# EAGLE design Encoder_v1 (EAGLE 7.5.0)
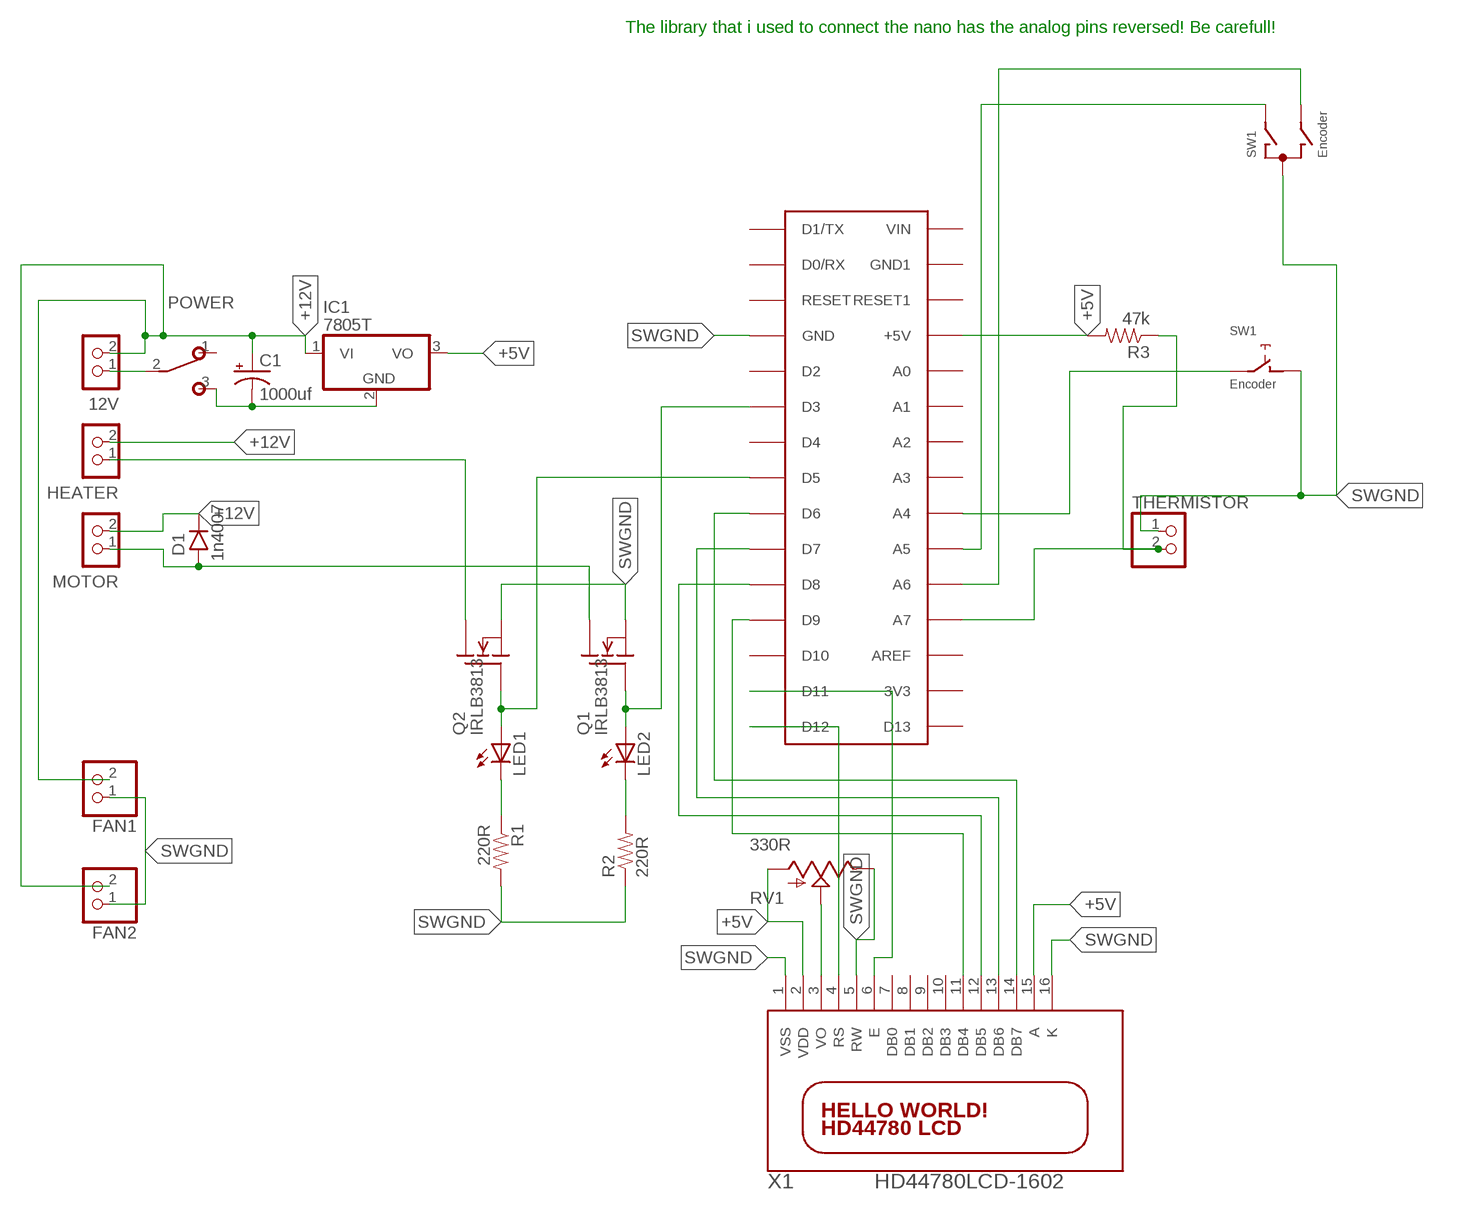
[diagram p0: schematic, sheet 1]

## Parts
12V  CON_TERMINAL_BLOCK_02-5MM  [TERMINAL_BLOCK_2P_5]
A01  ARDUINO NANO  ARDUINONANO  [PDIP-32]
C1  1000uf  CAP_POLPTH4  [CPOL-RADIAL-1000UF-25V]
D1  1n4007  1N400X.4  [DO41-4]
FAN1  PINHD-1X2  [1X02]
FAN2  PINHD-1X2  [1X02]
HEATER  CON_TERMINAL_BLOCK_02-5MM  [TERMINAL_BLOCK_2P_5]
IC1  7805T  [TO220H]
LED1  LED5MM  [LED5MM]
LED2  LED5MM  [LED5MM]
MOTOR  CON_TERMINAL_BLOCK_02-5MM  [TERMINAL_BLOCK_2P_5]
POWER  SPDT  [M9040P]
Q1  IRLB3813  IRF620  [TO220]
Q2  IRLB3813  IRF620  [TO220]
R1  220R  RESISTORPTH-1/4W  [AXIAL-0.4]
R2  220R  RESISTORPTH-1/4W  [AXIAL-0.4]
R3  47k  RESISTORPTH-1/4W  [AXIAL-0.4]
RV1  330R  POTTRIM  [TRIM_POT]
SW1  Encoder  EC12E_SW  [ALPS_EC12E_SW]
THERMISTOR  PINHD-1X2  [1X02]
X1  HD44780LCD-1602  [LCD1602]

## Nets
+5V: A01.+5V IC1.3(VO) R3.P$2 RV1.3(A) X1.2(VDD) X1.15(A)
+12V: 12V.2 C1.1(+) D1.C FAN1.2 FAN2.2 HEATER.2 IC1.1(VI) MOTOR.2
N$1: LED1.K(C) R1.P$1
N$2: RV1.1(S) X1.3(VO)
N$3: A01.A4 SW1.E
N$4: 12V.1 POWER.2(P)
N$5: A01.A6 SW1.B
N$6: A01.A7 R3.P$1 THERMISTOR.2
N$7: A01.A5 SW1.A
N$8: LED2.K(C) R2.P$2
N$9: A01.D5 LED1.A Q2.1(G)
N$10: A01.D6 X1.14(DB7)
N$11: A01.D7 X1.13(DB6)
N$12: D1.A MOTOR.1 Q1.2(D)
N$13: A01.D3 LED2.A Q1.1(G)
N$14: A01.D8 X1.12(DB5)
N$15: A01.D9 X1.11(DB4)
N$16: HEATER.1 Q2.2(D)
N$17: A01.D11 X1.6(E)
N$18: A01.D12 X1.4(RS)
SWGND: A01.GND C1.2(-) FAN1.1 FAN2.1 IC1.2(GND) POWER.3(S) Q1.3(S) Q2.3(S) R1.P$2 R2.P$1 RV1.2(E) SW1.C SW1.D THERMISTOR.1 X1.1(VSS) X1.5(RW) X1.16(K)
Unconnected: A01.3V3 A01.A0 A01.A1 A01.A2 A01.A3 A01.AREF A01.D0/RX A01.D1/TX A01.D2 A01.D4 A01.D10 A01.D13 A01.GND1 A01.RESET A01.RESET1 A01.VIN POWER.1(O) SW1.GND1(G) SW1.GND2(G) X1.7(DB0) X1.8(DB1) X1.9(DB2) X1.10(DB3)

## Notes on the sheet
- The library that i used to connect the nano has the analog pins reversed! Be carefull!

## Library data of the parts
12V HEATER MOTOR = dp_devices:CON_TERMINAL_BLOCK_02: 2 poles wire to board terminal block
A01 = jet-lib:ARDUINONANO
C1 = SparkFun-Passives:CAP_POL: Capacitor Polarized These are standard SMD and PTH capacitors. Normally 10uF, 47uF, and 100uF in electrolytic and tantalum varieties. Always verify the external diameter of the through hole cap, it varies with capacity, voltage, and manufacturer. The EIA devices should be standard.
D1 = gm-diodes:1N400X: Rectifier Diodes often used in power supply to prevent damage from reverse polarization
FAN1 FAN2 THERMISTOR = pinhead:PINHD-1X2: PIN HEADER
IC1 = adafruit:78*: Positive VOLTAGE REGULATOR Added bigger pads to the TO-92 package
LED1 LED2 = adafruit:LED: LED OSRAM: - CHIPLED LG R971, LG N971, LY N971, LG Q971, LY Q971, LO R971, LY R971 LH N974, LH R974 LS Q976, LO Q976, LY Q976 LO Q996 - Hyper CHIPLED LW Q18S LB Q993, LB Q99A, LB R99A - SideLED LS A670, LO A670, LY A670, LG A670, LP A670 LB A673, LV A673, LT A673, LW A673 LH A674 LY A675 LS A676, LA A676, LO A676, LY A676, LW A676 LS A679, LY A679, LG A679 - Hyper Micro SIDELED® LS Y876, LA Y876, LO Y876, LY Y876 LT Y87S - SmartLED LW L88C, LW L88S LB L89C, LB L89S, LG L890 LS L89K, LO L89K, LY L89K LS L896, LA L896, LO L896, LY L896 - TOPLED LS T670, LO T670, LY T670, LG T670, LP T670 LSG T670, LSP T670, LSY T670, LOP T670, LYG T670 LG T671, LOG T671, LSG T671 LB T673, LV T673, LT T673, LW T673 LH T674 LS T676, LA T676, LO T676, LY T676, LB T676, LH T676, LSB T676, LW T676 LB T67C, LV T67C, LT T67C, LS T67K, LO T67K, LY T67K, LW E67C LS E67B, LA E67B, LO E67B, LY E67B, LB E67C, LV E67C, LT E67C LW T67C LS T679, LY T679, LG T679 LS T770, LO T770, LY T770, LG T770, LP T770 LB T773, LV T773, LT T773, LW T773 LH T774 LS E675, LA E675, LY E675, LS T675 LS T776, LA T776, LO T776, LY T776, LB T776 LHGB T686 LT T68C, LB T68C - Hyper Mini TOPLED® LB M676 - Mini TOPLED Santana® LG M470 LS M47K, LO M47K, LY M47K Source: http://www.osram.convergy.de/
POWER = gm-switches:SPDT: TOGGLE SWITCH Marquardt
Q1 Q2 = transistor-fet:IRF620: N-Channel Enhancement MOSFET (HEXFET); 200V; 5,2A; 0,8Ohm
R1-R3 = SparkFun-Passives:RESISTOR: Resistor Basic schematic elements and footprints for 0603, 1206, and PTH resistors.
RV1 = SparkFun-Electromechanical:POT
SW1 = switch-alps:EC12E_SW: ALPS rotary Encoder EC12E series with switch; MPN: EC12E2424407; OC_FARNELL: 1520813; OC_NEWARK: 74M1068
X1 = adafruit:HD44780LCD: HD44780 LCD Standard character type LCDs, available in sizes from 8x1 to 40x4!

## Board
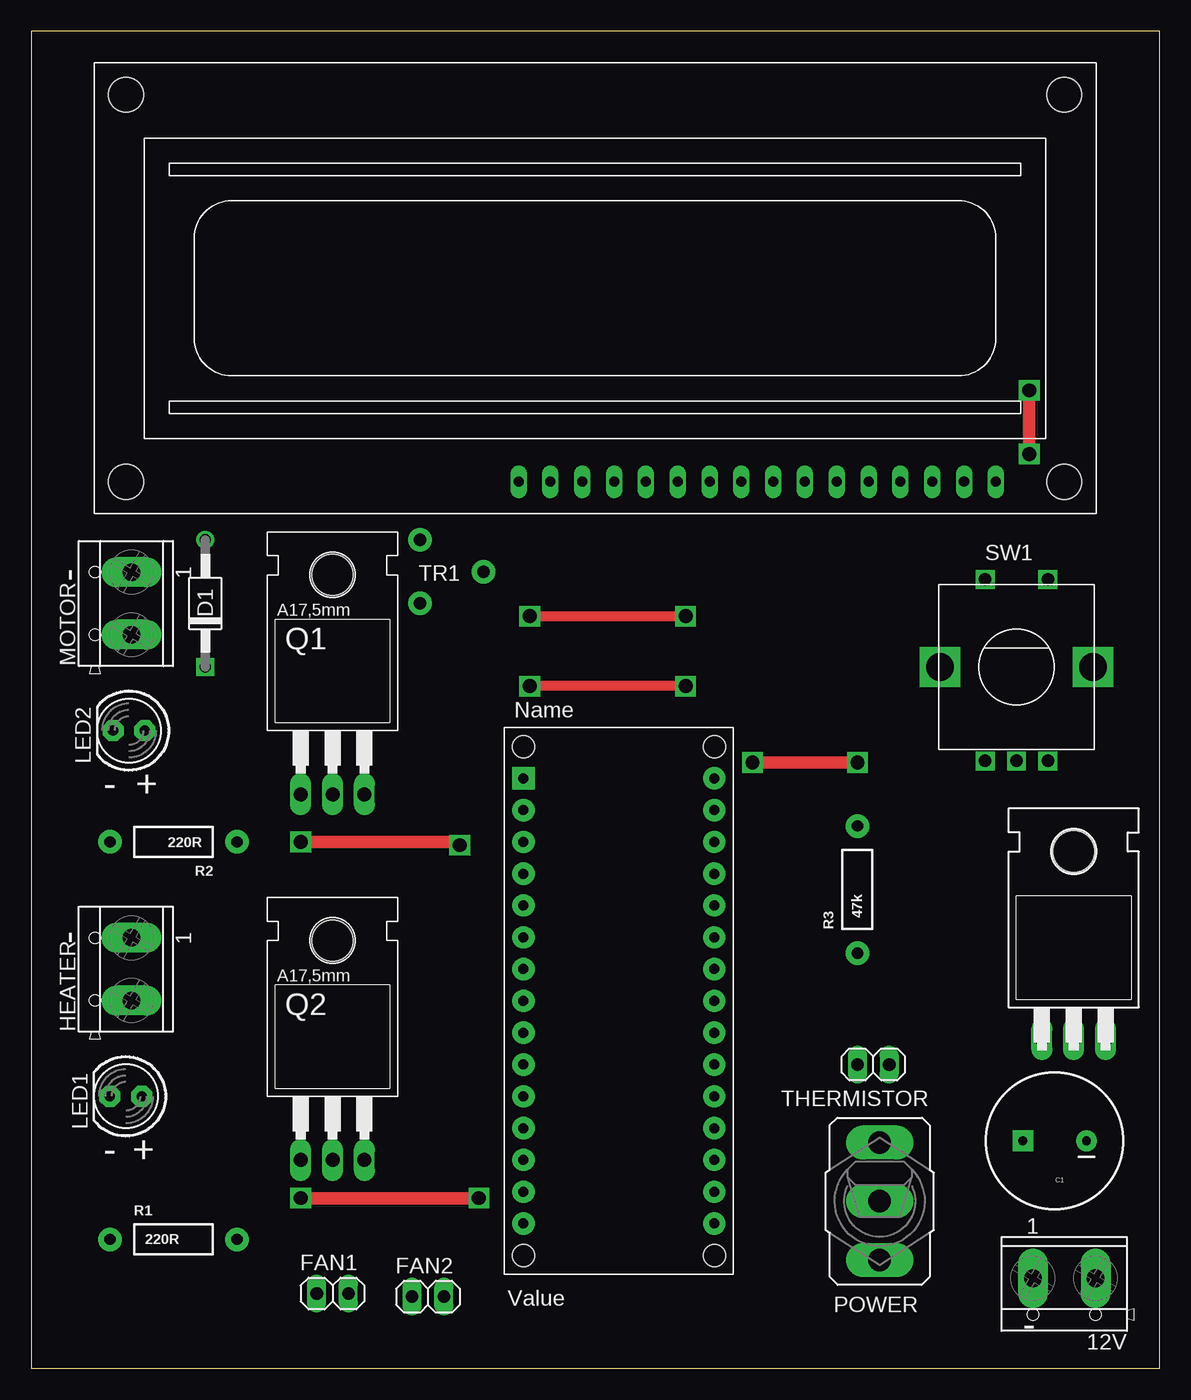
[diagram p1: board, top side]
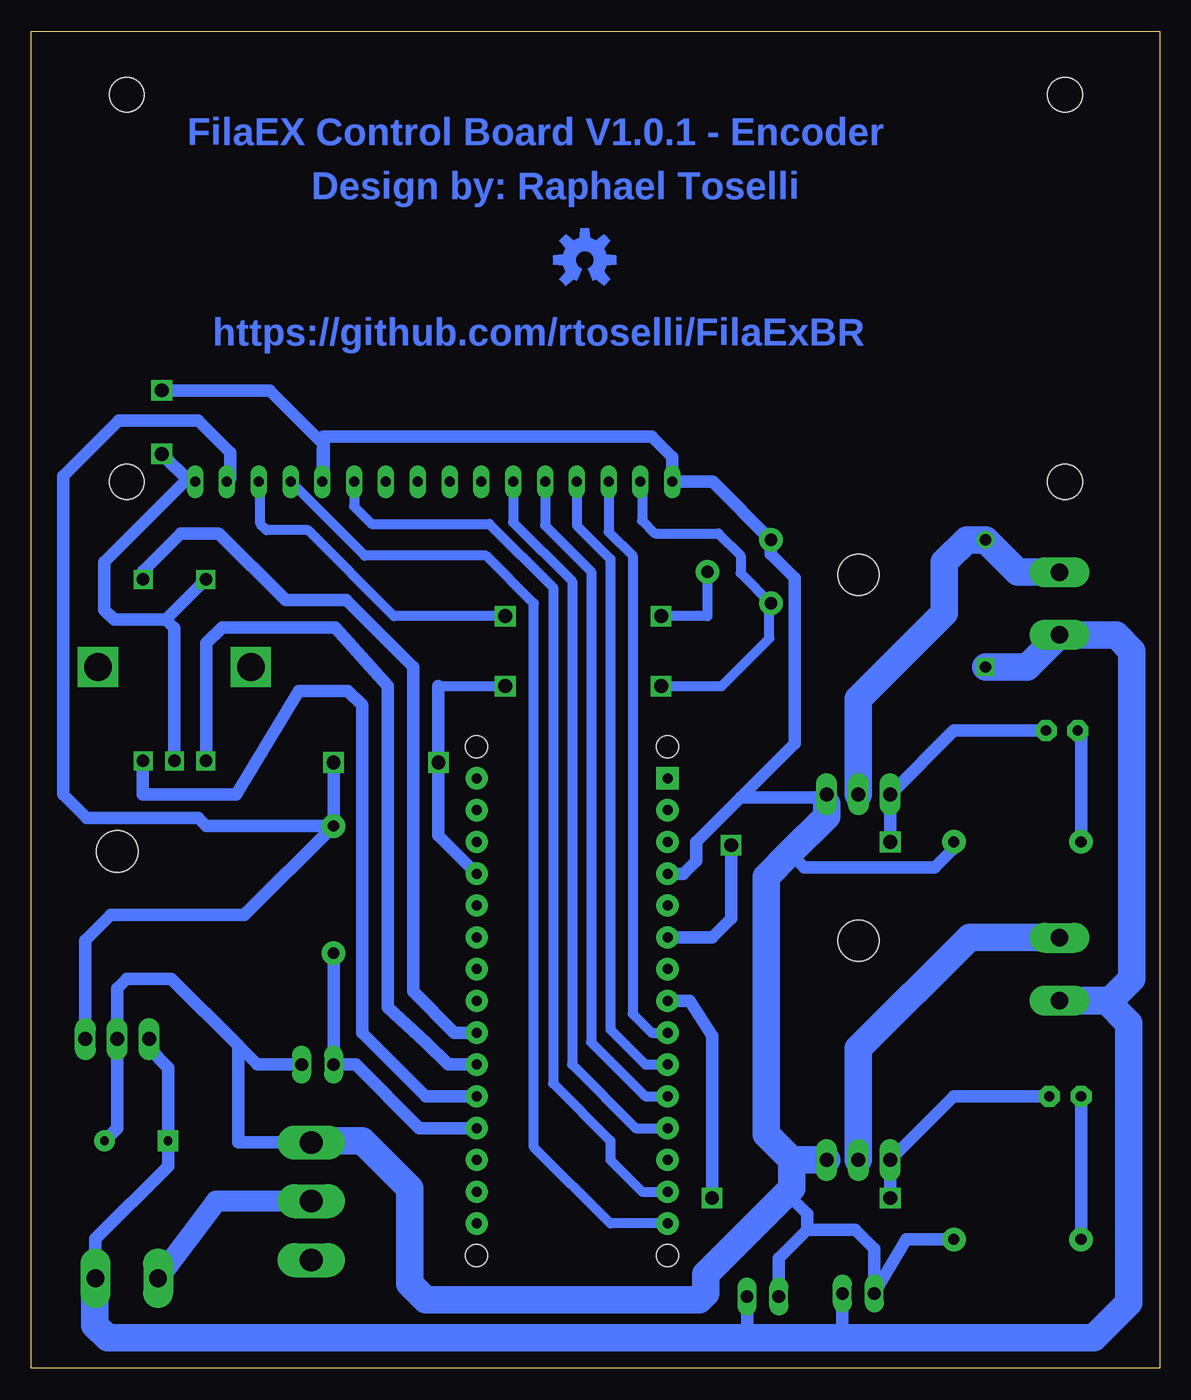
[diagram p2: board, bottom side, seen from below]

Size 90.09 x 106.79 mm. Coordinates in mm from the lower left corner, seen from the top.
Outline: 90.09,0 90.09,106.79 0,106.79 0,0 90.09,0
Copper layers (1*16): Top 0.035mm / dielectric 1.5mm / Bottom 0.035mm
Design rules "default": minimum track width 10mil, minimum drill 24mil, track to track 8mil, track to pad 8mil, pad to pad 8mil, via to via 8mil, smd to smd 8mil, copper to edge 40mil, drill to drill 8mil, minimum pad ring 10mil, minimum via ring 8mil, stop-mask expansion 4mil, vias tented up to drill 0mil, thermal gap 10mil

### Footprints (pad centres in the part's own frame; a part is rotated, then mirrored left to right if it is on the bottom)
TERMINAL_BLOCK_2P_5 = drill 1.4 pad 2.38 long: 1 2.5,-0.45; 2 -2.5,-0.45
PDIP-32 = drill 0.8 pad 1.778: 3V3 15.24,-35.56; +5V 15.24,-10.16; A0 15.24,-12.7; A1 15.24,-15.24; A2 15.24,-17.78; A3 15.24,-20.32; A4 15.24,-22.86; A5 15.24,-25.4; A6 15.24,-27.94; A7 15.24,-30.48; AREF 15.24,-33.02; D0/RX 0,-5.08; D2 0,-12.7; D3 0,-15.24; D4 0,-17.78; D5 0,-20.32; D6 0,-22.86; D7 0,-25.4; D8 0,-27.94; D9 0,-30.48; D10 0,-33.02; D11 0,-35.56; D12 0,-38.1; D13 15.24,-38.1; GND 0,-10.16; GND1 15.24,-5.08; RESET 0,-7.62; RESET1 15.24,-7.62; VIN 15.24,-2.54 | drill 0.8 pad 1.778 square: D1/TX 0,-2.54 | hole 1.778: 0,0; 0,-40.64; 15.24,-40.64; 15.24,0
CPOL-RADIAL-1000UF-25V = drill 0.7 pad 1.651 square: 1 2.54,0 | drill 0.7 pad 1.651: 2 -2.54,0
DO41-4 = drill 0.9: A 5.08,0 | drill 0.9 square: C -5.08,0
1X02 = drill 1.016 long: 1 -1.27,0; 2 1.27,0
TO220H = drill 1.118 long: 1 -2.54,-10.16; 2 0,-10.16; 3 2.54,-10.16 | hole 3.302: 0,4.826
LED5MM = drill 0.813 pad 1.676 octagon: A -1.27,0; K 1.27,0
M9040P = drill 1.803 long: 1 0,4.699; 2 0,0; 3 0,-4.699
TO220 = drill 1.118 long: 1 -2.54,-6.35; 2 0,-6.35; 3 2.54,-6.35 | hole 3.302: 0,11.176
AXIAL-0.4 = drill 0.9 pad 1.88: P$1 -5.08,0; P$2 5.08,0
TRIM_POT = drill 1 pad 1.88: 1 5.08,0; 2 0,2.54; 3 0,-2.54
ALPS_EC12E_SW = drill 1 square: A -2.5,-7.5; B 2.5,-7.5; C 0,-7.5; D -2.5,7; E 2.5,7 | drill 2.2 square: GND1 -6.1,0; GND2 6.1,0
LCD1602 = drill 0.8 long: 1 8,33.46; 2 10.54,33.46; 3 13.08,33.46; 4 15.62,33.46; 5 18.16,33.46; 6 20.7,33.46; 7 23.24,33.46; 8 25.78,33.46; 9 28.32,33.46; 10 30.86,33.46; 11 33.4,33.46; 12 35.94,33.46; 13 38.48,33.46; 14 41.02,33.46; 15 43.56,33.46; 16 46.1,33.46 | hole 2.8: 2.54,2.54; 2.54,33.46; 77.46,33.46; 77.46,2.54

### Placement (x,y rotation side)
12V  82.47,6.73 180 top
A01  39.29,49.66 0 top
C1  81.71,18.16 180 top
D1  13.89,61.09 90 top
FAN1  24.05,5.97 0 top
FAN2  31.67,5.71 0 top
HEATER  7.54,31.88 90 top
IC1  83.24,36.45 0 top
LED1  7.54,21.72 180 top
LED2  7.8,50.93 180 top
MOTOR  7.54,61.09 90 top
POWER  67.74,13.33 180 top
Q1  24.05,52.2 0 top
Q2  24.05,22.99 0 top
R1  11.35,10.29 0 top
R2  11.35,42.04 180 top
R3  65.96,38.23 90 top
RV1  31.04,63.63 0 top
SW1  78.66,56.01 0 top
THERMISTOR  67.23,24.26 180 top
U$3  [OSHW-LOGO-M_COPPER]  45.9,88.52 0 bottom
X1  85.01,104.27 180 top

### Tracks (layer width: path | path; a pad name or v marks a point on that pad's centre or on a via)
+5V  (via drill 1.1 pad 1.27)
  Top 0.813: v52.25,54.48 v39.8,54.48
  Top 1.016: v65.96,48.39 v57.58,48.39
  Bottom 0.813: 41.33,70.68 41.33,67.69 40.31,66.67 35.23,66.67 33.45,64.9 33.45,63.5 RV1.3 31.17,60.96 31.17,58.29 34.98,54.48 v39.8,54.48 | 57.58,54.48 v52.25,54.48
  Bottom 1.016: R3.P$2 76.12,43.31 76.76,43.94 85.65,43.94 87.55,45.85 87.55,71.25 83.11,75.69 76.76,75.69 74.22,73.15 74.22,71.06 X1.2 | 41.33,70.68 X1.15 | A01.+5V 57.58,42.54 v57.58,48.39 57.58,54.48 | R3.P$2 v65.96,48.39 | IC1.3 85.78,34.16 83.74,36.2 73.08,36.2 R3.P$2
+12V
  Bottom 1.016: 12V.2 84.97,10.33 79.17,16.13 C1.1 79.17,24 80.7,25.53 IC1.1 | FAN1.2 25.32,2.41 | FAN2.2 32.94,2.41
  Bottom 1.676: MOTOR.2 6.31,58.59 | 85.01,5.71 85.01,8.66 12V.2
  Bottom 2.184: 85.01,5.71 85.01,3.43 84,2.41 32.94,2.41 25.32,2.41 5.26,2.41 2.46,5.21 2.46,27.56 4.24,29.34 7.95,29.34 HEATER.2 3.95,29.38 2.21,31.12 2.21,57.28 3.48,58.55 7.95,58.55 MOTOR.2 10.57,56.01 D1.C
N$1
  Bottom 1.016: R1.P$1 LED1.K
N$2  (via drill 1.1 pad 1.27)
  Top 0.813: v39.8,60.07 v52.25,60.07
  Bottom 0.813: X1.3 71.81,70.68 71.81,67.44 71.3,66.93 68,66.93 61.14,60.07 v52.25,60.07 | RV1.1 36.12,60.07 v39.8,60.07
N$3
  Bottom 1.016: SW1.E 81.16,63.67 78.16,66.67 75.11,66.67 69.77,61.34 64.95,61.34 59.61,56.01 59.61,30.1 56.31,26.8 A01.A4
N$4
  Bottom 1.676: POWER.2 75.34,13.33 12V.1
N$5
  Bottom 1.016: SW1.B 81.2,48.47 81.2,45.85 73.71,45.85 68.76,54.1 64.82,54.1 63.68,52.96 63.68,26.8 58.6,21.72 A01.A6
N$6
  Bottom 1.016: A01.A7 59.11,19.18 64.19,24.26 THERMISTOR.2 R3.P$1
N$7
  Bottom 1.016: SW1.A 76.12,48.55 76.12,57.91 74.85,59.18 65.84,59.18 61.65,54.48 61.65,28.83 58.6,26.04 56.82,24.26 A01.A5
N$8
  Bottom 1.016: LED2.K 6.27,50.93 R2.P$2
N$9  (via drill 1.1 pad 1.27)
  Top 1.016: v21.51,13.59 v35.74,13.59
  Bottom 1.016: A01.D5 37.52,29.34 35.74,26.54 v35.74,13.59 | v21.51,13.59 Q2.1 16.43,21.72 LED1.A
N$10
  Bottom 0.813: X1.14 43.99,66.8 42.09,64.9 42.09,28.32 40.56,26.8 A01.D6
N$11
  Bottom 0.813: X1.13 46.53,67.31 43.87,64.64 43.87,27.05 41.07,24.26 A01.D7
N$12
  Bottom 1.676: 24.05,45.21 Q1.2
  Bottom 2.184: MOTOR.1 11.31,63.59 D1.A 15.42,66.17 17.2,64.39 17.2,60.32 24.05,53.47 Q1.2
N$13  (via drill 1.1 pad 1.27)
  Top 1.016: v21.51,42.04 33.96,42.04 v34.21,41.78
  Bottom 1.016: v21.51,42.04 Q1.1 16.43,50.93 LED2.A | A01.D3 35.74,34.42 34.21,35.94 v34.21,41.78
N$14
  Bottom 0.813: X1.12 49.07,67.31 45.39,63.63 45.39,26.04 41.07,21.72 A01.D8
N$15
  Bottom 0.813: X1.11 51.61,67.56 46.91,62.86 46.91,24.26 41.83,19.18 A01.D9
N$16
  Bottom 1.676: 8.03,34.42 HEATER.1
  Bottom 2.184: 8.03,34.42 15.16,34.42 24.05,25.53 Q2.2
N$17
  Bottom 0.813: X1.6 64.31,68.83 62.92,67.44 53.52,67.44 48.44,62.36 48.44,22.73 43.87,18.16 43.87,16.64 41.33,14.1 A01.D11
N$18
  Bottom 0.813: A01.D12 43.87,11.56 49.96,17.65 49.96,61.09 53.77,64.9 63.48,64.9 X1.4
SWGND  (via drill 1.1 pad 1.27)
  Top 1.016: v79.68,73.02 v79.68,78.11
  Bottom 1.016: R2.P$1 16.43,41.53 17.96,40 28.37,40 29.52,41.15 | A01.GND 38.02,39.5 37.01,40.51 37.01,42.04 33.45,45.59 | 33.45,45.59 26.85,45.59 Q1.3 | R1.P$2 20.24,10.29 FAN1.1 22.78,9.53 24.31,11.05 28.12,11.05 | FAN2.1 30.4,8.76 28.12,11.05 | v79.68,73.02 77.46,70.81 X1.1 77.83,70.81 84.25,64.39 84.25,60.58 83.49,59.82 79.35,59.82 | v79.68,78.11 71.04,78.11 66.73,73.79 66.73,70.94 X1.5 66.8,74.42 40.56,74.42 38.91,72.77 X1.16 35.68,70.81 RV1.2 31.04,65.02 29.13,63.12 29.13,49.91 33.45,45.59 | 79.35,59.82 SW1.D | SW1.C 78.66,59.13 79.35,59.82 | POWER.3 68.25,18.03 73.58,18.03 73.58,25.78 | 73.58,25.78 78.92,31.12 82.47,31.12 83.24,30.35 IC1.2 83.24,19.18 C1.2 | THERMISTOR.1 72.06,24.26 73.58,25.78 | 28.12,11.05 28.12,12.32 29.77,13.97
  Bottom 1.676: Q1.3 26.59,45.09
  Bottom 2.184: 26.59,45.09 26.59,44.07 29.52,41.15 31.42,39.24 31.42,18.67 29.39,16.64 | 29.39,16.64 Q2.3 | 29.39,16.64 29.39,14.35 29.77,13.97 36.25,7.49 36.25,5.97 36.75,5.46 58.6,5.46 59.87,6.73 59.87,14.35 63.68,18.16 68.12,18.16 68.25,18.03

### Text on the board
Bottom: FilaEX Control Board V1.0.1 - Encoder | Design by: Raphael Toselli | https://github.com/rtoselli/FilaExBR
tNames: - | TR1 | - | + | - | - | + | -